# EAGLE design ESP32_can (EAGLE 6.4)
DESCRIPTION: microOBD 200 OBD-II Module; HW_REV: 1.4; PCB_REV: C; PCB_SPEC1: Layer Count: 4; PCB_SPEC2: Size: 1.3" x 0.59"; PCB_SPEC3: Finish Thickness: 0.049" - 0.052"; PCB_SPEC4: Copper Weight: 1oz; TITLE: STM1120

## Sheet 1 of 2
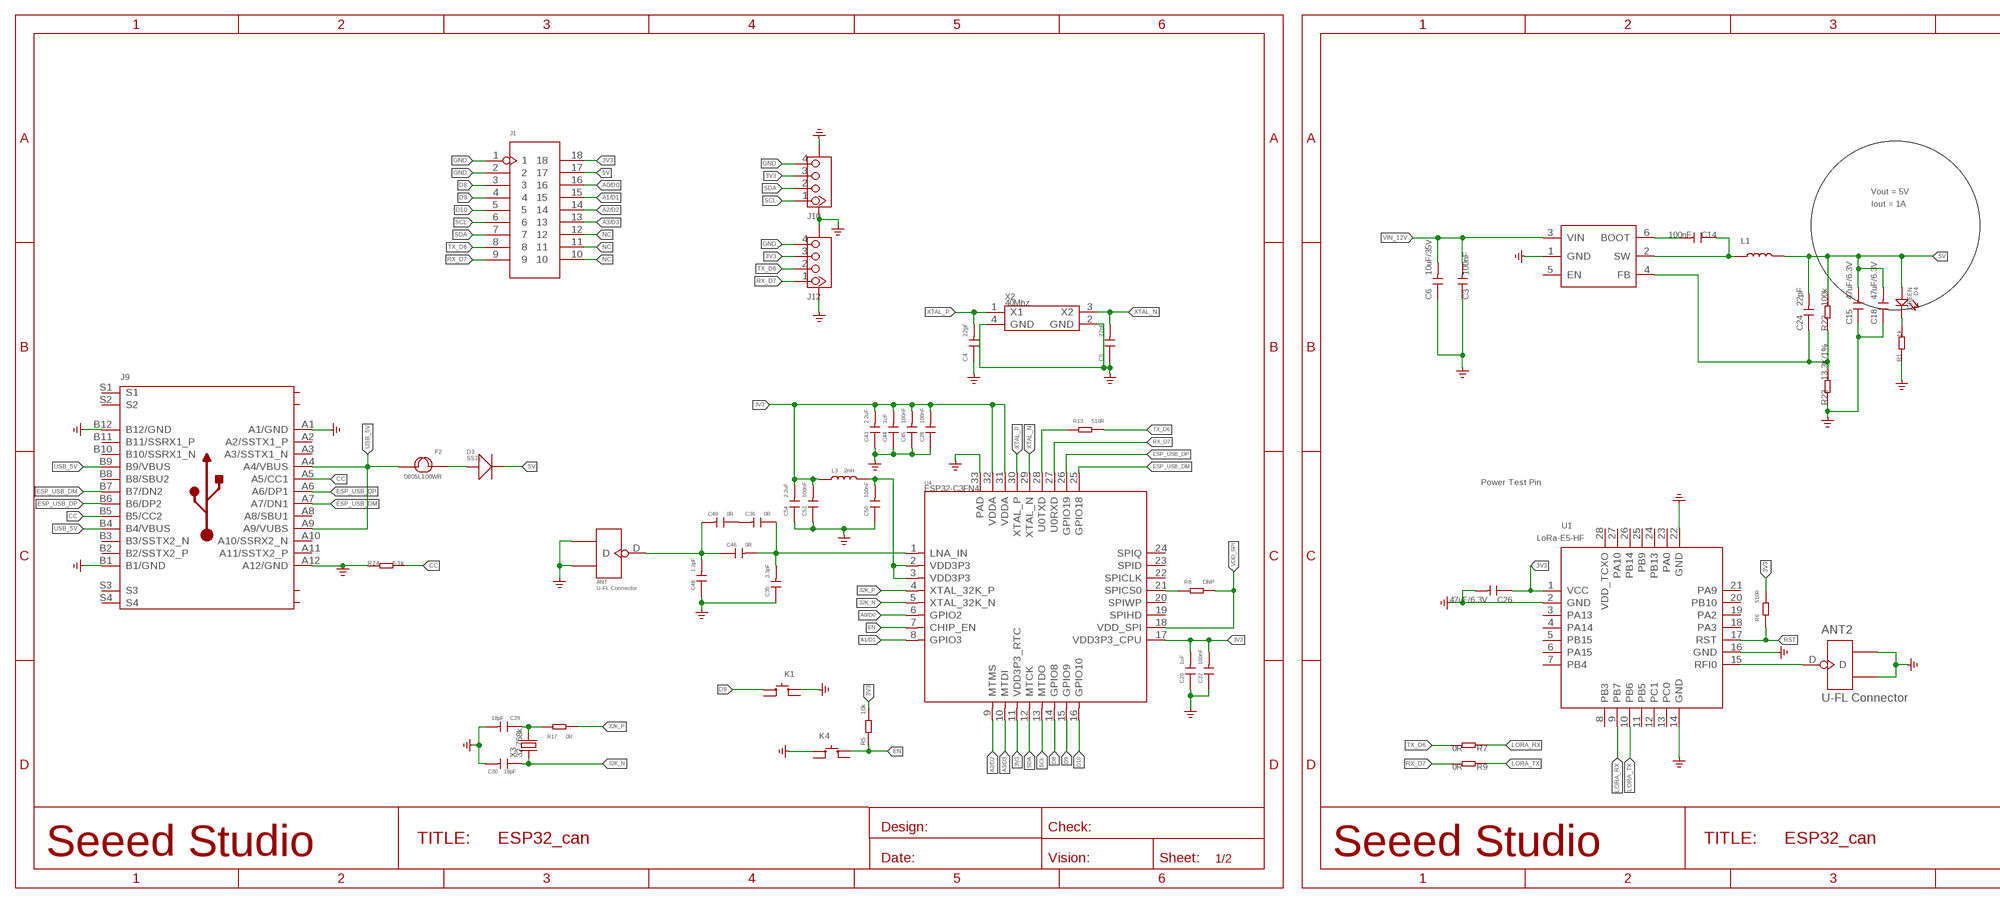
[diagram p0: schematic, sheet 1, part 1 of 2]
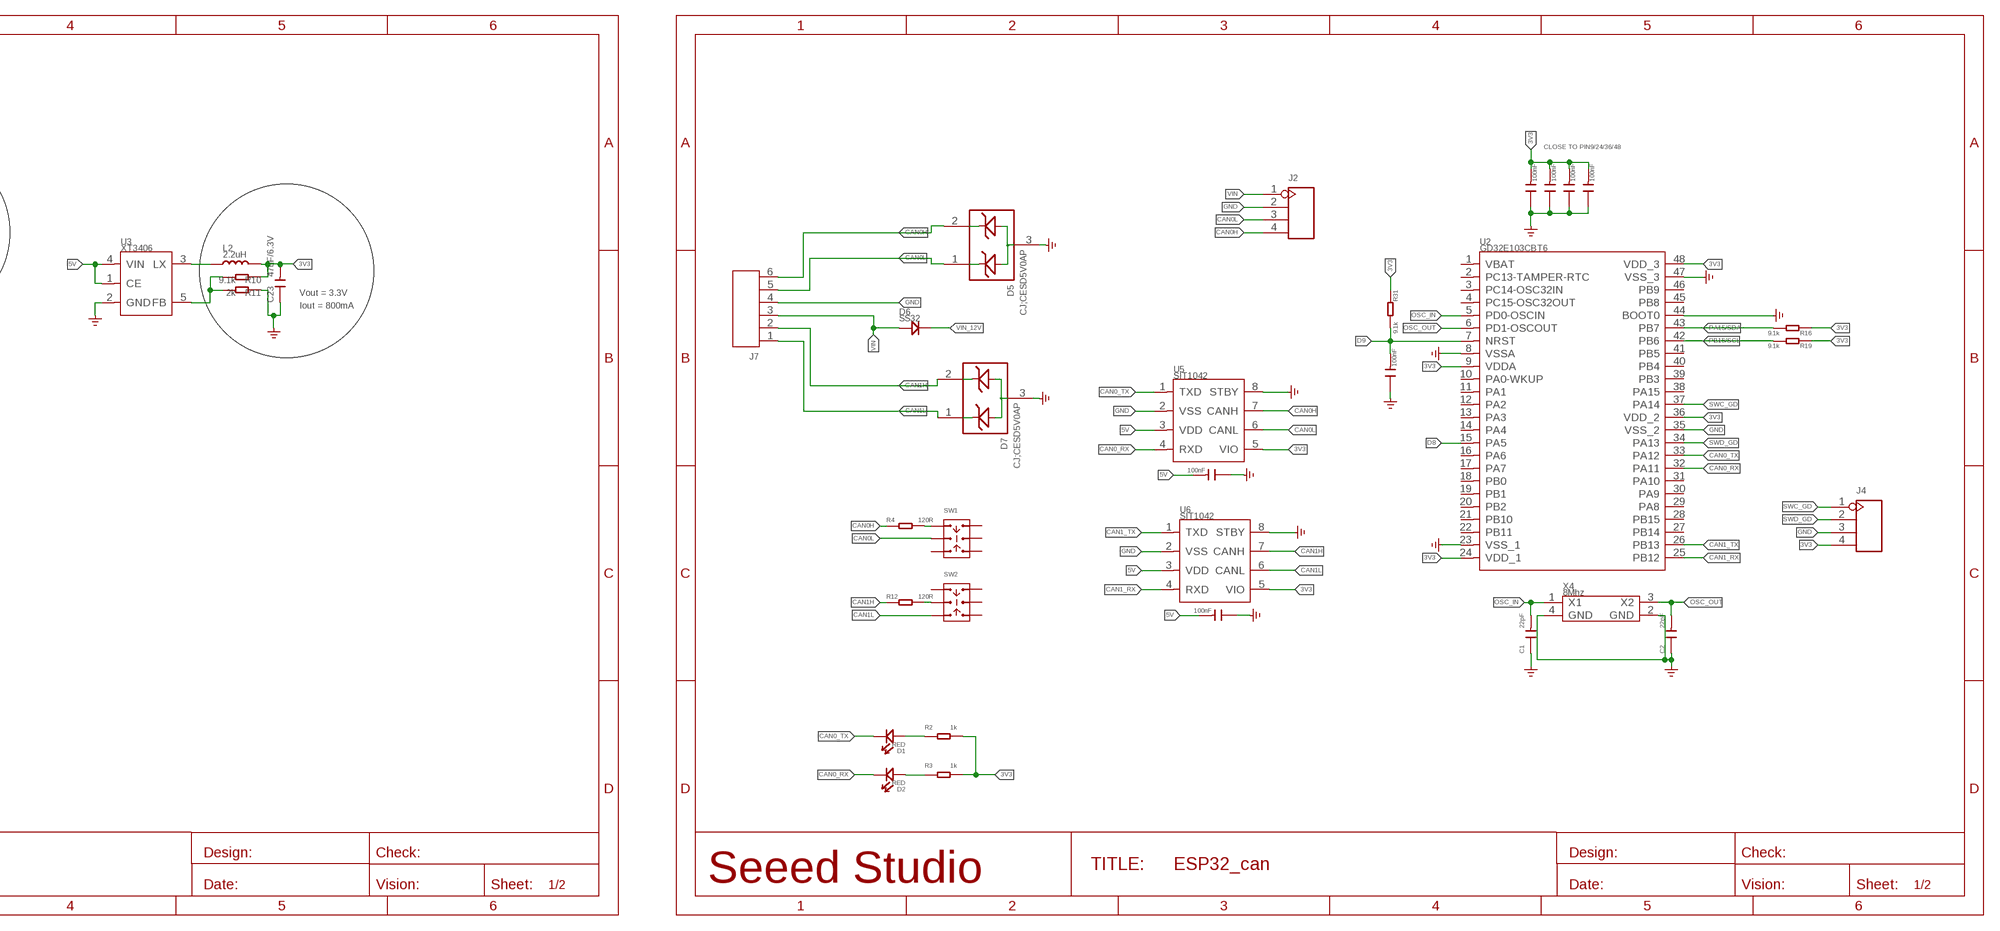
[diagram p1: schematic, sheet 1, part 2 of 2]

### Parts
ANT  U-FL Connector  ANTENNA-U-FL-320110048  [U-FL3P-SMD-2.6X2.6X1.0MM]
ANT2  U-FL Connector  ANTENNA-U-FL-320110048  [U-FL3P-SMD-2.6X2.6X1.0MM]
C1  22pF  CAP-0603  [C0603]
C2  22pF  CAP-0603  [C0603]
C3  100nF  CAP-0603  [C0603]
C4  22pF  CAP-0603  [C0603]
C5  22pF  CAP-0603  [C0603]
C6  10uF/35V  CAP-1206  [C1206]
C7  100nF  CAP-0603  [C0603]
C8  100nF  CAP-0603  [C0603]
C9  100nF  CAP-0603  [C0603]
C10  100nF  CAP-0603  [C0603]
C14  100nF  CAP-0603  [C0603]
C15  47uF/6.3V  CAP-0805  [C0805]
C16  100nF  CAP-0603  [C0603]
C17  100nF  CAP-0603  [C0603]
C18  47uF/6.3V  CAP-0805  [C0805]
C19  100nF  CAP-0603  [C0603]
C20  1uF  CAP-0603  [C0603]
C22  100nF  CAP-0603  [C0603]
C23  47uF/6.3V  CAP-0805  [C0805]
C24  22pF  CAP-0603  [C0603]
C26  47uF/6.3V  CAP-0805  [C0805]
C28  100nF  CAP-0603  [C0603]
C29  18pF  CAP-0603  [C0603]
C30  18pF  CAP-0603  [C0603]
C35  3.3pF  CAP-0603  [C0603]
C36  0R  CAP-0603  [C0603]
C43  2.2uF  CAP-0603  [C0603]
C44  1uF  CAP-0603  [C0603]
C45  100nF  CAP-0603  [C0603]
C46  0R  CAP-0603  [C0603]
C48  1.2pF  CAP-0603  [C0603]
C49  0R  CAP-0603  [C0603]
C50  100nF  CAP-0603  [C0603]
C53  100nF  CAP-0603  [C0603]
C54  2.2uF  CAP-0603  [C0603]
D1  RED  LED'0603'  [LED-0603]
D2  RED  LED'0603'  [LED-0603]
D3  SS32  DIODE'SMA'  [DO-214AC@2]
D4  GREEN  LED'0603'  [LED-0603]
D5  CJ;CESD5V0AP  D-ESD-3P'CESD3V3AP'  [SOT-23]
D6  SS32  DIODE'SMA'  [DO-214AC]
D7  CJ;CESD5V0AP  D-ESD-3P'CESD3V3AP'  [SOT-23]
F2  0805L100WR  FUSE0805  [F0805]
J1  HEADER-2X9P-2.54  [H2X9-2.54]
J2  HEADER-4P-80/40MIL  [H4-2.54-C80D40MIL]
J4  HEADER-4P-65/35MIL  [H4-2.54]
J7  SCREW-TERMINAL-6P-5.0  [H6-5.0-31.6X12.5X12MM]
J9  USB-TYPE-C-90  [TYPE-C-0.5-8.94X3.16X9.2MM]
J10  GROVE-CONNECTOR-SMD-320110030  [HW4-SMD-2.0]
J12  GROVE-CONNECTOR-SMD-320110030  [HW4-SMD-2.0]
K1  BUTTON-4P-6.2X6.2  [SW4-SMD-6.2X6.2MM]
K4  BUTTON-4P-6.2X6.2  [SW4-SMD-6.2X6.2MM]
L1  INDUCTOR-SPD3D16-4R7M  [L0420]
L2  2.2uH  INDUCTOR-3030  [L3030-TAIYO-YUDEN-NR3012]
L3  2nH  INDUCTOR'0603'  [L0603]
R1  1k  RES-0603  [R0603]
R2  1k  RES-0603  [R0603]
R3  1k  RES-0603  [R0603]
R4  120R  RES-0603  [R0603]
R5  10k  RES-0603  [R0603]
R6  510R  RES-0603  [R0603]
R7  0R  RES-0603  [R0603]
R8  DNP  RES-0603  [R0603]
R9  0R  RES-0603  [R0603]
R10  9.1k  RES-0603  [R0603]
R11  2k  RES-0603  [R0603]
R12  120R  RES-0603  [R0603]
R13  510R  RES-0603  [R0603]
R16  9.1k  RES-0603  [R0603]
R17  0R  RES-0603  [R0603]
R19  9.1k  RES-0603  [R0603]
R22  100k  RES-0603  [R0603]
R23  13.3K/1%  RES-0603  [R0603]
R24  5.1k  RES-0603  [R0603]
R31  9.1k  RES-0603  [R0603]
SW1  SWITCH-2CH-6P-311010004  [SW6-2.54-9.0X3.5X3.2+2.0MM]
SW2  SWITCH-2CH-6P-311010004  [SW6-2.54-9.0X3.5X3.2+2.0MM]
U1  LoRa-E5-HF  MOUDLE_LORA_E5  [MOUDLE28P-1.25-12X12X2.5MM]
U2  GD32E103CBT6  MCU-GD32E103CBT6  [LQFP48]
U3  XT3406  PMIC-XT3406  [SOT-23-5]
U4  ESP32-C3FN4  MCU-ESP32-C3  [QFN32G-0.5-5X5MM]
U5  SIT1042  TRANSCEIVER-MCP2542  [SOIC8-1.27-5X4MM]
U6  SIT1042  TRANSCEIVER-MCP2542  [SOIC8-1.27-5X4MM]
U9  PMIC-TPS54302  [SOT-23-6]
X2  40Mhz  CRYSTAL-4P-3225  [X4-SMD-3.2X2.5X0.7MM]
X3  32.768k  CRYSTAL-2P-1610  [X2-SMD-1.6X1.0X0.5MM]
X4  8Mhz  CRYSTAL-4P-3225  [X4-SMD-3.2X2.5X0.7MM]

### Nets
3V3: C7.2 C9.2 C16.2 C17.2 C20.2 C22.2 C23.2 C26.1 C28.2 C43.2 C44.2 C45.2 C53.2 C54.2 J1.18 J4.4 J10.3 J12.3 L2.2 L3.1 R2.2 R3.2 R5.2 R6.1 R10.1 R16.1 R19.1 R31.1 U1.1(VCC) U2.9(VDDA) U2.24(VDD_1) U2.36(VDD_2) U2.48(VDD_3) U4.11(VDD3P3_RTC) U4.17(VDD3P3_CPU) U4.31(VDDA) U4.32(VDDA) U5.5(VIO) U6.5(VIO)
5V: C8.2 C15.2 C18.2 C19.2 C24.2 D3.2(-) D4.+ J1.17 L1.2 R22.2 U3.1(CE) U3.4(VIN) U5.3(VDD) U6.3(VDD)
32K_N: C30.1 U4.5(XTAL_32K_N) X3.1
32K_P: R17.1 U4.4(XTAL_32K_P)
A0/D0: J1.16 U4.6(GPIO2)
A1/D1: J1.15 U4.8(GPIO3)
A2/D2: J1.14 U4.9(MTMS)
A3/D3: J1.13 U4.10(MTDI)
CAN0_RX: D2.- U2.32(PA11) U5.4(RXD)
CAN0_TX: D1.- U2.33(PA12) U5.1(TXD)
CAN0H: D5.2 J2.4 J7.6 R4.1 U5.7(CANH)
CAN0L: D5.1 J2.3 J7.5 SW1.COM1 U5.6(CANL)
CAN1_RX: U2.25(PB12) U6.4(RXD)
CAN1_TX: U2.26(PB13) U6.1(TXD)
CAN1H: D7.2 J7.2 R12.1 U6.7(CANH)
CAN1L: D7.1 J7.1 SW2.CH1B U6.6(CANL)
CC: J9.A5(A5/CC1) J9.B5(B5/CC2) R24.2
D8: J1.3 U2.15(PA5) U4.14(GPIO8)
D9: C10.2 J1.4 K1.2(B0) R31.2 U2.7(NRST) U4.15(GPIO9)
D10: J1.5 U4.16(GPIO10)
EN: K4.2(B0) R5.1 U4.7(CHIP_EN)
ESP_USB_DM: J9.A7(A7/DN1) J9.B7(B7/DN2) U4.25(GPIO18)
ESP_USB_DP: J9.A6(A6/DP1) J9.B6(B6/DP2) U4.26(GPIO19)
GND: ANT2.GND1 ANT2.GND2 ANT.GND1 ANT.GND2 C1.1 C2.1 C3.1 C4.1 C5.1 C6.1 C7.1 C8.1 C9.1 C10.1 C15.1 C16.1 C17.1 C18.1 C19.1 C20.1 C22.1 C23.1 C26.2 C28.1 C29.2 C30.2 C35.1 C43.1 C44.1 C45.1 C48.1 C50.1 C53.1 C54.1 D5.3 D7.3 J1.1 J1.2 J2.2 J4.3 J7.4 J9.A1(A1/GND) J9.A12(A12/GND) J9.B1(B1/GND) J9.B12(B12/GND) J10.4 J10.SS1 J10.SS2 J12.4 J12.SS1 J12.SS2 K1.1(A0) K4.1(A0) R1.1 R11.1 R23.1 R24.1 U1.2(GND) U1.14(GND) U1.16(GND) U1.22(GND) U2.8(VSSA) U2.23(VSS_1) U2.35(VSS_2) U2.44(BOOT0) U2.47(VSS_3) U3.2(GND) U4.33(PAD) U5.2(VSS) U5.8(STBY) U6.2(VSS) U6.8(STBY) U9.1(GND) X2.2(GND) X2.4(GND) X4.2(GND) X4.4(GND) ; supply symbol labelled GND_POWER
LORA_RX: R7.1 U1.9(PB7)
LORA_TX: R9.1 U1.10(PB6)
N$1: D4.- R1.2
N$2: D1.+ R2.1
N$3: C14.1 L1.1 U9.2(SW)
N$4: ANT2.D U1.15(RFI0)
N$5: R4.2 SW1.CH1A
N$7: R12.2 SW2.COM1
N$8: L2.1 U3.3(LX)
N$11: D3.1(+) F2.1
N$14: R13.2 U4.28(U0TXD)
N$15: D2.+ R3.1
N$16: R10.2 R11.2 U3.5(FB)
N$17: R8.1 U4.21(SPICS0)
N$21: C29.1 R17.2 X3.2
N$22: C35.2 C36.1 C46.2 U4.1(LNA_IN)
N$23: C36.2 C49.1
N$27: C14.2 U9.6(BOOT)
N$28: ANT.D C46.1 C48.2 C49.2
N$29: C24.1 R22.1 R23.2 U9.4(FB)
N$34: C50.2 L3.2 U4.2(VDD3P3) U4.3(VDD3P3)
NC: J1.10 J1.11 J1.12
OSC_IN: C1.2 U2.5(PD0-OSCIN) X4.1(X1)
OSC_OUT: C2.2 U2.6(PD1-OSCOUT) X4.3(X2)
PA15/SDA: R16.2 U2.43(PB7)
PB15/SCL: R19.2 U2.42(PB6)
RST: R6.2 U1.17(RST)
RX_D7: J1.9 J12.1 R9.2 U4.27(U0RXD)
SCL: J1.6 J10.1 U4.13(MTDO)
SDA: J1.7 J10.2 U4.12(MTCK)
SWC_GD: J4.1 U2.37(PA14)
SWD_GD: J4.2 U2.34(PA13)
TX_D6: J1.8 J12.2 R7.2 R13.1
USB_5V: F2.2 J9.A4(A4/VBUS) J9.A9(A9/VUBS) J9.B4(B4/VBUS) J9.B9(B9/VBUS)
VDD_SPI: R8.2 U4.18(VDD_SPI)
VIN: D6.1(+) J2.1 J7.3
VIN_12V: C3.2 C6.2 D6.2(-) U9.3(VIN)
XTAL_N: C5.2 U4.29(XTAL_N) X2.3(X2)
XTAL_P: C4.2 U4.30(XTAL_P) X2.1(X1)
Unconnected: J9.A2(A2/SSTX1_P) J9.A3(A3/SSTX1_N) J9.A8(A8/SBU1) J9.A10(A10/SSRX2_N) J9.A11(A11/SSTX2_P) J9.B2(B2/SSTX2_P) J9.B3(B3/SSTX2_N) J9.B8(B8/SBU2) J9.B10(B10/SSRX1_N) J9.B11(B11/SSRX1_P) J9.S1 J9.S2 J9.S3 J9.S4 K1.3(B1) K1.4(A1) K4.3(B1) K4.4(A1) SW1.CH1B SW1.CH2A SW1.CH2B SW1.COM2 SW2.CH1A SW2.CH2A SW2.CH2B SW2.COM2 U1.3(PA13) U1.4(PA14) U1.5(PB15) U1.6(PA15) U1.7(PB4) U1.8(PB3) U1.11(PB5) U1.12(PC1) U1.13(PC0) U1.18(PA3) U1.19(PA2) U1.20(PB10) U1.21(PA9) U1.23(PA0) U1.24(PB13) U1.25(PB9) U1.26(PB14) U1.27(PA10) U1.28(VDD_TCXO) U2.1(VBAT) U2.2(PC13-TAMPER-RTC) U2.3(PC14-OSC32IN) U2.4(PC15-OSC32OUT) U2.10(PA0-WKUP) U2.11(PA1) U2.12(PA2) U2.13(PA3) U2.14(PA4) U2.16(PA6) U2.17(PA7) U2.18(PB0) U2.19(PB1) U2.20(PB2) U2.21(PB10) U2.22(PB11) U2.27(PB14) U2.28(PB15) U2.29(PA8) U2.30(PA9) U2.31(PA10) U2.38(PA15) U2.39(PB3) U2.40(PB4) U2.41(PB5) U2.45(PB8) U2.46(PB9) U4.19(SPIHD) U4.20(SPIWP) U4.22(SPICLK) U4.23(SPID) U4.24(SPIQ) U9.5(EN)

### Notes on the sheet
- CLOSE TO PIN9/24/36/48
- Vout = 5V
- Iout = 1A
- Vout = 3.3V
- Iout = 800mA
- Power Test Pin

## Sheet 2 of 2

## Library data of the parts
ANT ANT2 = Connector-new:ANTENNA-U-FL
C1-C10 C14-C20 C22-C24 C26 C28-C30 C35 C36 C43-C46 C48-C50 C53 C54 = Discrete-new:CAP: Ceramic Capacitors
D1 D2 D4 = Discrete-new:LED
D3 = Discrete-new:DIODE*
D5 D7 = Discrete-new:D-ESD-3P: 304060003
D6 = Discrete-new:DIODE
F2 = Discrete-small:FUSE
J1 = Connector-new:HEADER-2X9P
J2 J4 = Connector-new:HEADER-4P
J7 = 0617:SCREW-TERMINAL-6P: 320110059
J9 = Connector-new:USB-TYPE-C
J10 J12 = Connector-new:GROVE-CONNECTOR-SMD
K1 K4 = Switch:BUTTON-4P
L1-L3 = Discrete-new:INDUCTOR
R1-R13 R16 R17 R19 R22-R24 R31 = Discrete-new:RES
SW1 SW2 = Switch:SWITCH-2CH-6P
U1 = moudle-new:MOUDLE_LORA_E5
U2 = Longan-IC:MCU-GD32E103CBT6
U3 = PMIC:PMIC-XT3406
U4 = IC-new:MCU-ESP32-C3
U5 U6 = untitled:TRANSCEIVER-MCP2542
U9 = IC-new:PMIC-TPS54302
X2 X4 = Discrete-new:CRYSTAL-4P
X3 = Discrete-new:CRYSTAL-2P

## Net classes
3 usbvcc: width 0.152 mm, drill 0.152 mm, clearance 0.152 mm

## Board
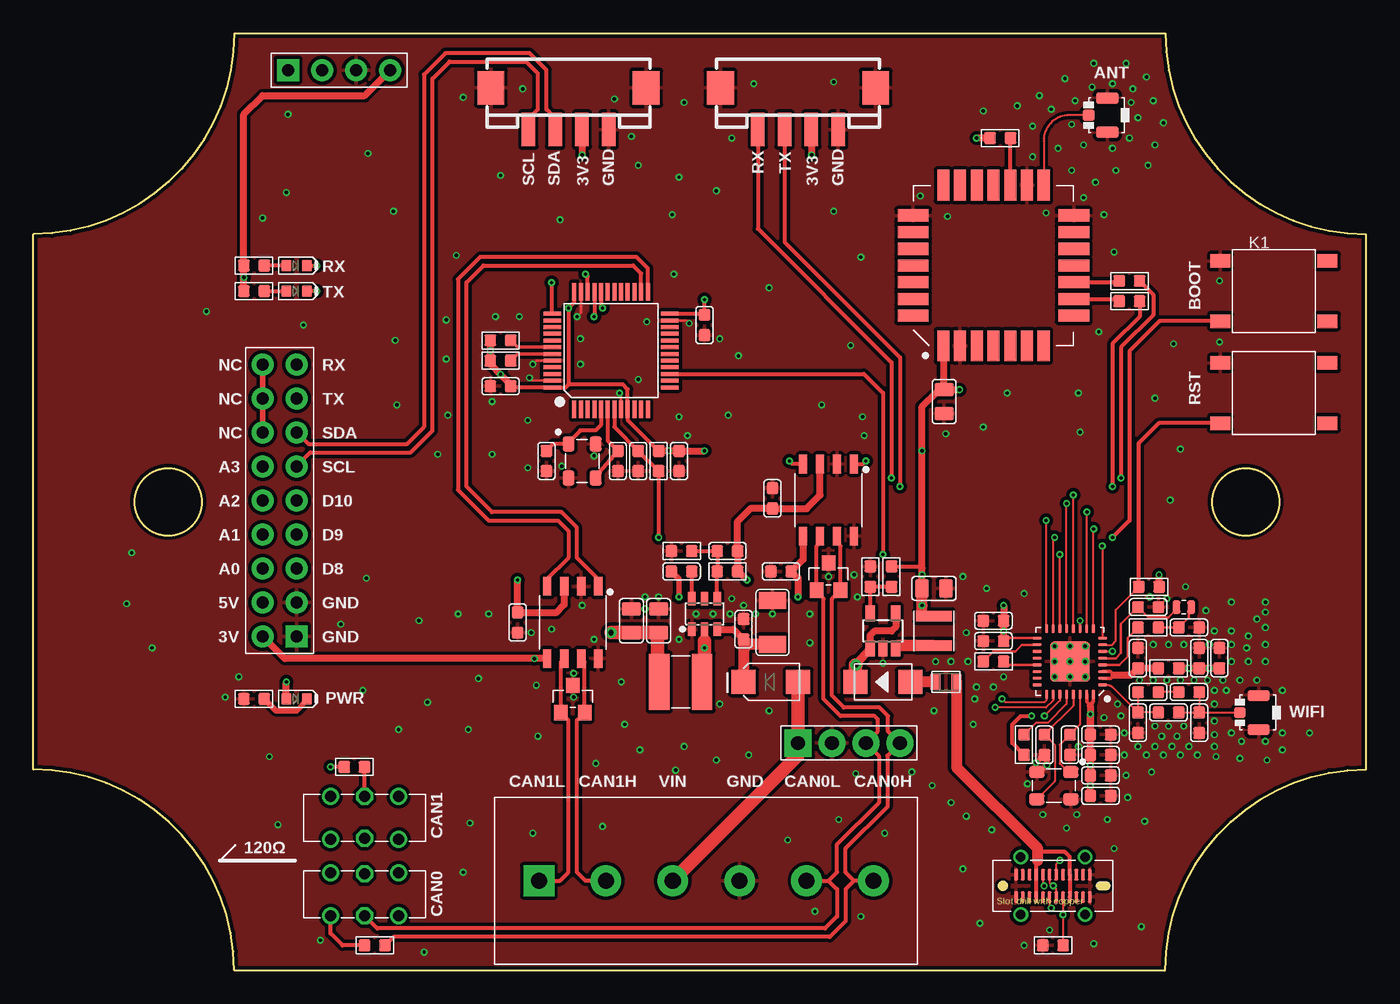
[diagram p2: board, top side]
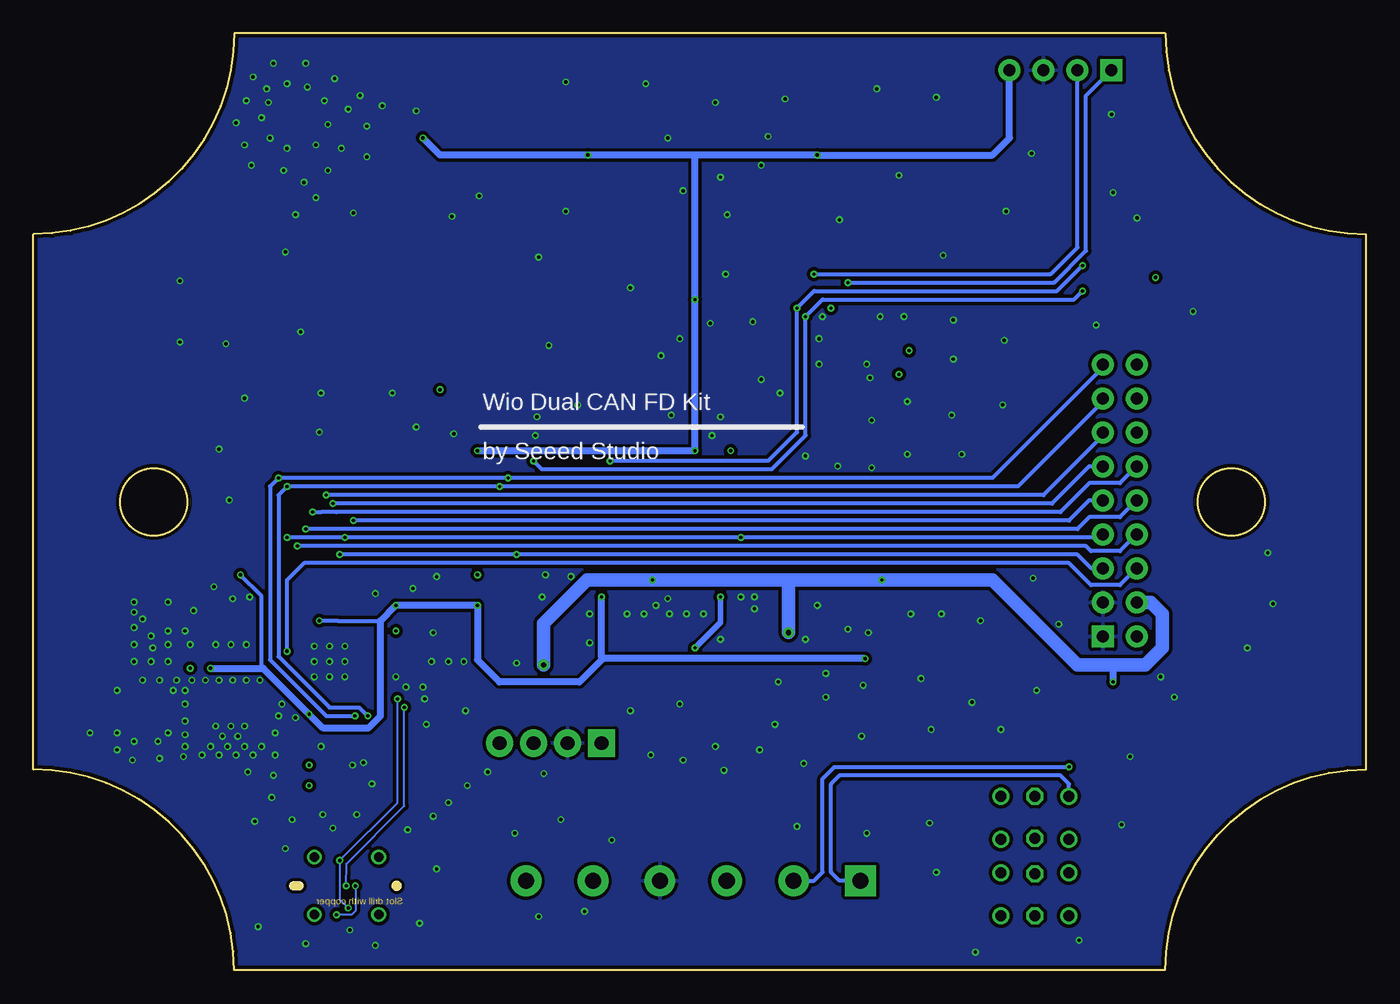
[diagram p3: board, bottom side, seen from below]

Size 99.57 x 70 mm. Coordinates in mm from the lower left corner, seen from the top.
Outline: 15,70 84.57,70 arc90 99.57,55 99.57,15 arc90 84.57,0 15,0 arc90 0,15 0,55 arc90 15,70
Outline: circle at 10.07,35 radius 2.5
Outline: circle at 90.57,35 radius 2.5
Copper layers (1*16): Top 0.035mm / dielectric 1.5mm / Bottom 0.035mm
Design rules "SeeedStudio_2layer_DRU_no_angle_20140221": minimum track width 1mil, minimum drill 10mil, track to track 6mil, track to pad 6mil, pad to pad 6mil, via to via 6mil, smd to smd 0mil, copper to edge 10mil, drill to drill 10mil, minimum pad ring 4mil, minimum via ring 4mil, stop-mask expansion 2mil, vias tented up to drill 25mil, thermal gap 10mil

### Footprints (pad centres in the part's own frame; a part is rotated, then mirrored left to right if it is on the bottom)
U-FL3P-SMD-2.6X2.6X1.0MM = smd 0.889 x 0.838: D -1.397,0 | smd 1.676 x 0.838: GND1 0,1.27; GND2 0,-1.27
C0603 = smd 0.889 x 0.889: 1 -0.762,0; 2 0.762,0
C1206 = smd 1.27 x 2.032: 1 -1.651,0; 2 1.651,0
C0805 = smd 1.016 x 1.397: 1 -0.889,0; 2 0.889,0
LED-0603 = smd 0.762 x 0.889: + 0.762,0; - -0.762,0
DO-214AC@2 = smd 1.8 x 1.77: 1 -2.042,0; 2 2.042,0
SOT-23 = smd 1.016 x 1.143: 1 -0.889,-1.016; 2 0.889,-1.016; 3 0,1.016
DO-214AC = smd 1.8 x 1.77: 1 2.042,0; 2 -2.042,0
F0805 = smd 0.819 x 1.27: 1 -0.79,0; 2 0.79,0
H2X9-2.54 = drill 0.889 pad 1.651 square: 1 -1.27,10.16 | drill 0.889 pad 1.651: 2 -1.27,7.62; 3 -1.27,5.08; 4 -1.27,2.54; 5 -1.27,0; 6 -1.27,-2.54; 7 -1.27,-5.08; 8 -1.27,-7.62; 9 -1.27,-10.16; 10 1.27,-10.16; 11 1.27,-7.62; 12 1.27,-5.08; 13 1.27,-2.54; 14 1.27,0; 15 1.27,2.54; 16 1.27,5.08; 17 1.27,7.62; 18 1.27,10.16
H4-2.54-C80D40MIL = drill 1.016 pad 2.032 square: 1 0,3.81 | drill 1.016 pad 2.032: 2 0,1.27; 3 0,-1.27; 4 0,-3.81
H4-2.54 = drill 0.889 pad 1.651 square: 1 0,3.81 | drill 0.889 pad 1.651: 2 0,1.27; 3 0,-1.27; 4 0,-3.81
H6-5.0-31.6X12.5X12MM = drill 1.2 pad 2.3 square: 1 -12.5,0 | drill 1.2 pad 2.3: 2 -7.5,0; 3 -2.5,0; 4 2.5,0; 5 7.5,0; 6 12.5,0
TYPE-C-0.5-8.94X3.16X9.2MM = smd 0.3 x 0.85: A1 -2.75,0.835; A2 -2.25,0.835; A3 -1.75,0.835; A4 -1.25,0.835; A5 -0.75,0.835; A6 -0.25,0.835; A7 0.25,0.835; A8 0.75,0.835; A9 1.25,0.835; A10 1.75,0.835; A11 2.25,0.835; A12 2.75,0.835; B1 2.75,-0.835; B2 2.25,-0.835; B3 1.75,-0.835; B4 1.25,-0.835; B5 0.75,-0.835; B6 0.25,-0.835; B7 -0.25,-0.835; B8 -0.75,-0.835; B9 -1.25,-0.835; B10 -1.75,-0.835; B11 -2.25,-0.835; B12 -2.75,-0.835 | drill 0.7 pad 1.1: S1 -2.4,2.15; S2 2.4,2.15; S3 2.4,-2.15; S4 -2.4,-2.15 | hole 0.65: -3.75,0 | hole 0.6: 3.55,0.001; 3.677,0.001; 3.804,0.001; 3.931,0.001; 3.951,0.001
HW4-SMD-2.0 = smd 1 x 2.5: 1 -3,0; 2 -1,0; 3 1,0; 4 3,0 | smd 2 x 2.5: SS1 -5.8,3.123; SS2 5.8,3.123
SW4-SMD-6.2X6.2MM = smd 1.5 x 1: 1 -4,2.25; 2 -4,-2.25; 3 4,-2.25; 4 4,2.25
L0420 = smd 1.5 x 4.2: 1 -1.6,0; 2 1.6,0
L3030-TAIYO-YUDEN-NR3012 = smd 0.8 x 2.7: 1 -1.1,0; 2 1.1,0
L0603 = smd 0.889 x 0.889: 1 -0.762,0; 2 0.762,0
R0603 = smd 0.889 x 0.889: 1 -0.762,0; 2 0.762,0
SW6-2.54-9.0X3.5X3.2+2.0MM = drill 0.813 pad 1.27: CH1A -2.54,-1.6; CH1B 2.54,-1.6; CH2A -2.54,1.6; CH2B 2.54,1.6 | drill 0.813 pad 1.27 octagon: COM1 0,-1.6; COM2 0,1.524
MOUDLE28P-1.25-12X12X2.5MM = smd 2.3 x 0.9: 1 -6,3.75; 2 -6,2.5; 3 -6,1.25; 4 -6,0; 5 -6,-1.25; 6 -6,-2.5; 7 -6,-3.75; 15 6,-3.75; 16 6,-2.5; 17 6,-1.25; 18 6,0; 19 6,1.25; 20 6,2.5; 21 6,3.75 | smd 0.9 x 2.3: 8 -3.75,-6; 9 -2.5,-6; 10 -1.25,-6; 11 0,-6; 12 1.25,-6; 13 2.5,-6; 14 3.75,-6; 22 3.75,6; 23 2.5,6; 24 1.25,6; 25 0,6; 26 -1.25,6; 27 -2.5,6; 28 -3.75,6
LQFP48 = smd 1.3 x 0.3: 1 -4.4,2.75; 2 -4.4,2.25; 3 -4.4,1.75; 4 -4.4,1.25; 5 -4.4,0.75; 6 -4.4,0.25; 7 -4.4,-0.25; 8 -4.4,-0.75; 9 -4.4,-1.25; 10 -4.4,-1.75; 11 -4.4,-2.25; 12 -4.4,-2.75; 25 4.4,-2.75; 26 4.4,-2.25; 27 4.4,-1.75; 28 4.4,-1.25; 29 4.4,-0.75; 30 4.4,-0.25; 31 4.4,0.25; 32 4.4,0.75; 33 4.4,1.25; 34 4.4,1.75; 35 4.4,2.25; 36 4.4,2.75 | smd 0.3 x 1.3: 13 -2.75,-4.4; 14 -2.25,-4.4; 15 -1.75,-4.4; 16 -1.25,-4.4; 17 -0.75,-4.4; 18 -0.25,-4.4; 19 0.25,-4.4; 20 0.75,-4.4; 21 1.25,-4.4; 22 1.75,-4.4; 23 2.25,-4.4; 24 2.75,-4.4; 37 2.75,4.4; 38 2.25,4.4; 39 1.75,4.4; 40 1.25,4.4; 41 0.75,4.4; 42 0.25,4.4; 43 -0.25,4.4; 44 -0.75,4.4; 45 -1.25,4.4; 46 -1.75,4.4; 47 -2.25,4.4; 48 -2.75,4.4
SOT-23-5 = smd 0.69 x 1.2: 1 -0.95,-1.3; 2 0,-1.3; 3 0.95,-1.3; 4 0.95,1.3; 5 -0.95,1.3
QFN32G-0.5-5X5MM = smd 0.25 x 0.7: 1 -1.75,-2.45; 2 -1.25,-2.45; 3 -0.75,-2.45; 4 -0.25,-2.45; 5 0.25,-2.45; 6 0.75,-2.45; 7 1.25,-2.45; 8 1.75,-2.45; 17 1.75,2.45; 18 1.25,2.45; 19 0.75,2.45; 20 0.25,2.45; 21 -0.25,2.45; 22 -0.75,2.45; 23 -1.25,2.45; 24 -1.75,2.45 | smd 0.7 x 0.25: 9 2.45,-1.75; 10 2.45,-1.25; 11 2.45,-0.75; 12 2.45,-0.25; 13 2.45,0.25; 14 2.45,0.75; 15 2.45,1.25; 16 2.45,1.75; 25 -2.45,1.75; 26 -2.45,1.25; 27 -2.45,0.75; 28 -2.45,0.25; 29 -2.45,-0.25; 30 -2.45,-0.75; 31 -2.45,-1.25; 32 -2.45,-1.75 | smd 3 x 3: 33 0,0
SOIC8-1.27-5X4MM = smd 0.6 x 1.4: 1 -1.905,-2.7; 2 -0.635,-2.7; 3 0.635,-2.7; 4 1.905,-2.7; 5 1.905,2.7; 6 0.635,2.7; 7 -0.635,2.7; 8 -1.905,2.7
SOT-23-6 = smd 0.55 x 1.016: 1 -0.95,-1.143; 2 0,-1.143; 3 0.95,-1.143; 4 0.95,1.143; 5 0,1.143; 6 -0.95,1.143
X4-SMD-3.2X2.5X0.7MM = smd 1.143 x 0.889: 1 -1.27,-1.016; 2 1.27,-1.016; 3 1.27,1.016; 4 -1.27,1.016
X2-SMD-1.6X1.0X0.5MM = smd 0.6 x 1: 1 -0.55,0; 2 0.55,0

### Placement (x,y rotation side)
ANT  91.54,19.25 0 top
ANT2  80.24,63.89 0 top
C1  38.33,38.05 90 top
C2  43.66,38.05 90 top
C3  53.06,25.48 270 top
C4  77.45,16.84 90 top
C5  75.54,16.84 90 top
C6  55.22,25.98 270 top
C7  55.86,29.79 0 top
C8  55.22,35.25 270 top
C9  50.14,48.21 90 top
C10  45.19,38.05 90 top
C14  48.43,29.79 0 top
C15  46.71,26.11 270 top
C16  34.9,43.64 0 top
C17  48.24,38.05 90 top
C18  44.68,26.11 270 top
C19  36.17,25.98 90 top
C20  71.73,26.11 0 top
C22  71.73,24.59 0 top
C23  67.29,28.52 180 top
C24  51.86,31.32 0 top
C26  68.05,42.49 270 top
C28  79.73,16.08 180 top
C29  86.34,25.6 0 top
C30  83.29,27.13 0 top
C35  82.53,18.49 90 top
C36  83.29,20.78 0 top
C43  79.73,13.03 180 top
C44  79.73,14.55 180 top
C45  79.73,17.6 180 top
C46  84.81,19.25 180 top
C48  87.1,18.49 90 top
C49  86.34,20.78 0 top
C50  82.53,23.32 270 top
C53  87.1,23.32 270 top
C54  88.62,23.32 270 top
D1  19.66,50.75 180 top
D2  19.66,52.65 180 top
D3  63.48,21.54 180 top
D4  19.66,20.27 180 top
D5  59.41,29.41 0 top
D6  55.09,21.54 0 top
D7  40.3,20.27 0 top
F2  68.17,21.54 0 top
J1  18.39,35.1 180 top
J2  60.94,16.97 90 top
J4  22.84,67.26 90 top
J7  50.27,6.68 0 top
J9  76.18,6.3 0 top
J10  39.98,62.81 0 top
J12  57.13,62.81 0 top
K1  92.69,50.75 0 top
K4  92.69,43.13 0 top
L1  48.36,21.54 180 top
L2  67.29,25.35 90 top
L3  84.81,22.55 180 top
R1  16.49,20.27 0 top
R2  16.49,50.75 180 top
R3  16.49,52.65 180 top
R4  25.5,1.85 180 top
R5  83.35,28.65 0 top
R6  72.24,62.18 0 top
R7  81.89,49.99 0 top
R8  71.73,23.06 180 top
R9  81.89,51.51 0 top
R10  64.11,29.41 270 top
R11  62.52,29.41 270 top
R12  23.98,15.19 0 top
R13  74.02,16.84 90 top
R16  34.9,45.54 0 top
R17  83.29,25.6 0 top
R19  34.9,47.06 0 top
R22  51.86,29.79 0 top
R23  48.43,31.32 0 top
R24  76.18,1.85 0 top
R31  46.71,38.05 270 top
SW1  24.74,5.66 0 top
SW2  24.74,11.38 180 top
U1  71.73,52.65 90 top
U2  43.16,46.3 90 top
U3  63.48,25.35 0 top
U4  77.45,23.06 90 top
U5  59.41,35.13 180 top
U6  40.3,25.98 180 top
U9  50.14,26.62 0 top
X2  76.24,13.79 180 top
X3  85.95,27.13 0 top
X4  41,38.05 270 top

### Tracks (layer width: path | path; a pad name or v marks a point on that pad's centre or on a via)
3V3  (via drill 0.25 pad 0.51)
  Top 0.152: U4.11 78.2,26.1 v78.21,26.11
  Top 0.203: U4.17 72.97,24.81 C22.2
  Top 0.254: U4.31 78.7,20.03 78.97,19.76 79.2,20.11 U4.32
  Top 0.305: R31.1 44.41,41.12 U2.9 44.41,43.4 44.04,43.76 39.98,43.76 | v66.4,29.54 C23.2 | U2.24 50.06,49.05 C9.2 v50.14,50.11 | C16.2 35.75,43.55 U2.48 39.77,43.55 39.98,43.76 | U2.36 40.41,49.9 v39.98,49.48 39.98,43.76 | R10.1 66.27,30.17 66.4,30.05
  Top 0.508: L3.1 v86.34,22.55 C53.2 v87.86,22.55 C54.2 | 78.97,19.76 v78.97,19.12 | C22.2 v72.49,25.35 C20.2 v72.49,27.25 | R31.1 v47.47,38.81 C17.2 v50.14,38.81 | C43.2 v78.97,13.79 C44.2 v78.97,15.32 C28.2 v78.97,19.12 | v78.97,19.12 C45.2 | U5.5 57.51,30.68 C7.2 57.13,29.29 v57.13,27.89 | U1.1 67.98,43.45 C26.1 | R19.1 v34.14,46.3 R16.1 34.14,45.29 v34.9,44.52 35.66,43.76 C16.2 | R5.2 v84.11,29.54 | C26.1 v69.19,43.38 | R6.1 v70.46,62.18 | J12.3 58.13,60.92 v58.14,60.91 | J10.3 40.98,60.92 v41,60.91 | R2.2 v15.72,51.76 R3.2 15.72,63.96 17.12,65.35 24.74,65.35 J4.4 | C23.2 66.4,30.05 v66.4,38.81 66.4,42.11 67.54,43.26 67.92,43.26 C26.1 | U6.5 v37.44,23.28 18.78,23.28 J1.18
  Top 0.813: L2.2 66.57,26.45 66.4,26.62 v66.4,27.25 C23.2
  Bottom 0.305: v86.34,22.55 83.29,22.55 | 82.53,22.55 82.53,27.95 v84.11,29.54 | v72.49,27.25 73.65,26.1 76.85,26.1 78.2,26.1 v78.21,26.11
  Bottom 0.508: v86.34,22.55 82.53,22.55 82.4,22.55 v78.97,19.12 77.95,18.11 74.53,18.11 73.64,19 73.64,26.11 v72.49,27.25 v66.4,27.25 66.4,23.19 64.75,21.54 58.78,21.54 57.13,23.19 57.13,23.44 | 50.01,60.91 v41,60.91 27.92,60.91 26.65,62.18 J4.4 | 50.01,60.91 v58.14,60.91 69.19,60.91 v70.46,62.18 | 50.01,60.91 50.14,60.78 v50.14,50.11 v50.14,38.81 v66.4,38.81 | v37.44,23.28 56.97,23.28 57.13,23.44 | 57.13,23.44 v57.13,27.89
5V  (via drill 0.25 pad 0.51, 0.38 pad 0.81)
  Top 0.508: U5.3 58.78,35.51 57.76,34.49 C8.2 53.57,34.49 52.62,33.54 C24.2 R22.2 52.68,29.79 v53.32,29.16 | v36.17,29.16 C19.2 39.09,26.75 39.66,27.32 U6.3 | U3.4 64.43,25.66 64.11,25.35 62.84,25.35 62.53,25.03 U3.1 | D4.+ v18.9,21.54
  Top 0.635: U3.1 61.51,22.87 v61.44,22.81 61.44,21.8 D3.2
  Top 0.813: L1.2 46.64,25.04 C15.2 C18.2
  Top 1.016: 46.64,25.04 46.64,22.25 46.71,22.17 | 46.58,25.22 C18.2 v43.16,25.22 | D3.2 v61.43,22.8 v61.44,22.81
  Bottom 0.508: v18.9,21.54 18.9,22.81
  Bottom 1.016: J1.17 16.08,27.48 15.22,26.62 15.22,24.08 16.49,22.81 18.9,22.81 21.57,22.81 27.92,29.16 v36.17,29.16 43.16,29.16 | 43.16,29.16 v53.32,29.16 58.21,29.16 61.44,25.92 v61.44,22.81 | v43.16,25.22 43.16,29.16
32K_N
  Top 0.203: U4.5 80.87,23.31 81.26,23.7 81.26,25.86 C30.1 83.29,26.36 84.81,26.36 85.41,26.96 X3.1
32K_P
  Top 0.203: U4.4 81.13,22.81 81.76,23.45 81.76,24.84 R17.1
A0/D0  (via drill 0.25 pad 0.51)
  Top 0.152: U4.6 80.61,23.81 v80.62,23.82
  Bottom 0.305: J1.16 17.15,30.02 18.39,28.78 20.55,28.78 22.2,30.43 79.35,30.43 80.62,29.16 v80.62,23.82
A1/D1  (via drill 0.25 pad 0.51)
  Top 0.152: U4.8 79.9,31.66 v79.86,31.7
  Bottom 0.305: J1.15 17.15,32.56 18.39,31.32 20.55,31.32 20.93,31.7 v79.86,31.7
A2/D2  (via drill 0.25 pad 0.51)
  Top 0.152: U4.9 79.2,32.94 v79.22,32.97
  Bottom 0.305: J1.14 17.15,35.1 18.39,33.86 20.68,33.86 21.57,32.97 v79.22,32.97
A3/D3  (via drill 0.25 pad 0.51)
  Top 0.152: U4.10 78.7,34.22 v78.72,34.24
  Bottom 0.305: J1.13 17.15,37.64 18.39,36.4 20.68,36.4 22.84,34.24 76.94,34.24 78.08,34.24 v78.72,34.24
CAN0_RX  (via drill 0.25 pad 0.51)
  Top 0.305: D2.- v21.19,52.65 | U2.32 42.41,49.59 v42.52,49.48 | U5.4 56.71,37.83 v56.49,38.05
  Bottom 0.305: v21.19,52.65 23.09,50.75 41.25,50.75 v42.52,49.48 42.52,40.21 44.68,38.05 v56.49,38.05
CAN0_TX  (via drill 0.25 pad 0.51)
  Top 0.305: U2.33 41.91,48.86 v41.89,48.84 | v21.19,50.75 D1.- | U5.1 61.98,37.83 v62.21,38.05
  Bottom 0.305: v21.19,50.75 21.82,50.11 40.62,50.11 v41.89,48.84 41.89,39.95 44.43,37.41 61.57,37.41 v62.21,38.05
CAN0H
  Top 0.305: R4.1 26.9,2.49 59.51,2.49 60.68,3.66 60.68,6.04 61.32,6.68 | U5.7 60.17,32.3 60.17,31.82 60.3,31.7 D5.2 59.67,27.76 59.67,20.52 60.55,19.63 63.22,19.63 63.86,19 63.86,17.86 J2.4 63.79,16.01 63.79,12.2 60.68,9.09 60.68,7.31 61.32,6.68 | J7.6 61.32,6.68
CAN0L
  Top 0.305: U5.6 58.78,31.95 58.52,31.7 D5.1 59.03,27.76 59.03,20.27 60.3,19 62.84,19 63.09,18.74 63.09,17.86 J2.3 63.16,16.01 63.16,12.52 60.05,9.41 60.05,7.31 59.41,6.68 | J7.5 59.41,6.68 | 59.41,6.68 60.05,6.04 60.05,4.01 59.16,3.12 25.68,3.12 SW1.COM1
CAN1_RX
  Top 0.305: U6.4 38.39,29.22 39.98,30.81 39.98,32.81 39.19,33.6 34.01,33.6 31.73,35.89 31.73,51.64 33.38,53.29 45.06,53.29 45.91,52.44 U2.25
CAN1_TX
  Top 0.305: U6.1 42.2,29.22 40.62,30.81 40.62,33.07 39.45,34.24 34.27,34.24 32.36,36.14 32.36,51.38 33.63,52.65 44.81,52.65 45.41,52.05 U2.26
CAN1H  (via drill 0.25 pad 0.51)
  Top 0.305: J7.2 41.25,6.68 40.62,7.31 40.62,18.68 D7.2 41.19,23.03 U6.7 | R12.1 v22.2,15.19
  Bottom 0.305: J7.2 41.25,6.68 40.62,7.31 40.62,14.3 39.73,15.19 v22.2,15.19
CAN1L
  Top 0.305: J7.1 39.35,6.68 39.98,7.31 39.98,18.68 D7.1 39.41,23.03 U6.6
  Bottom 0.305: J7.1 39.35,6.68 39.98,7.31 39.98,13.92 39.35,14.55 22.84,14.55 22.2,13.92 SW2.CH1B
CC  (via drill 0.25 pad 0.51)
  Top 0.152: J9.A5 75.43,6.39 v75.52,6.3 | J9.B5 v76.93,4.14 76.93,3.38 76.93,1.86
  Top 0.305: 76.93,1.86 R24.2
  Bottom 0.152: v75.52,6.3 75.52,4.42 75.8,4.14 v76.93,4.14
D8  (via drill 0.25 pad 0.51)
  Top 0.152: U4.14 76.7,31.05 v76.68,31.06
  Top 0.305: U2.15 62.05,44.55 63.48,43.13 v63.48,31.06
  Bottom 0.305: J1.3 20.52,30.02 21.57,31.06 v63.48,31.06 v76.68,31.06
D9  (via drill 0.25 pad 0.51)
  Top 0.152: U4.15 76.2,32.19 v76.3,32.33
  Top 0.305: v46.71,32.33 R31.2 C10.2 43.41,40.59 U2.7 | v80.62,32.33 81.89,33.6 81.89,46.25 84.14,48.5 K1.2
  Bottom 0.305: J1.4 19.69,32.56 19.91,32.33 v46.71,32.33 v76.3,32.33 v80.62,32.33
D10  (via drill 0.25 pad 0.51)
  Top 0.152: U4.16 75.7,33.58 v75.67,33.6
  Bottom 0.305: J1.5 20.7,35.1 22.2,33.6 v75.67,33.6
EN
  Top 0.152: U4.7 80.6,24.31 80.88,24.59 80.88,26.94 R5.1
  Top 0.305: R5.1 82.59,39.38 84.09,40.88 K4.2
ESP_USB_DM  (via drill 0.25 pad 0.51)
  Top 0.152: U4.25 75.7,20.17 75.54,20.01 72.62,20.01 v72.37,20.27 | J9.A7 76.43,7.95 v76.68,8.2 | J9.B7 75.92,4.77 v76.05,4.65
  Bottom 0.152: v76.05,4.65 76.68,5.28 v76.68,8.2 72.37,12.52 v72.37,20.27
ESP_USB_DP  (via drill 0.25 pad 0.51)
  Top 0.152: U4.26 76.2,20.18 75.65,19.63 v71.86,19.63 | J9.B6 76.43,6.07 v76.2,6.3 75.93,6.57 J9.A6
  Bottom 0.152: v76.2,6.3 76.17,7.95 71.86,12.27 v71.86,19.63
GND  (via drill 0.25 pad 0.51)
  Top 0.203: U2.35 40.91,49.13 v40.62,48.84 | U2.23 48.78,48.55 v49,48.34 | U2.44 37.58,45.55 v37.31,45.29 | U2.47 37.28,44.05 v37.06,44.27 | U2.8 43.91,42.99 v43.79,43.13 | C30.2 v84.69,27.76 | C4.1 v78.08,16.71
  Top 0.406: C5.1 75.48,16.08 v74.91,15.51 | 75.67,16.08 75.73,16.01 v75.73,15.32 75.67,15.32 75.03,14.68
  other vias: 83.54,14.81 82.65,21.66 83.67,21.66 84.69,21.66 85.7,21.66 86.72,21.66 87.73,21.66 81,19.89 81.26,19 83.8,18.24 84.81,18.24 85.95,18.24 82.53,16.71 83.8,16.71 85.07,16.71 86.34,16.71 84.3,17.47 85.45,17.47 88.24,19.89 88.24,20.9 88.24,18.62 88.24,17.6 88.24,16.71 88.88,21.66 90.15,21.66 91.42,21.66 93.32,20.9 89.13,20.9 93.32,16.46 92.18,15.7 92.05,17.09 93.32,17.73 95.35,17.73 90.27,17.09 89.51,17.73 81.51,17.73 49.51,26.62 50.78,26.62 46.71,27.89 52.05,26.62 53.95,26.62 53.06,27.25 55.22,26.62 69.83,23.06 58.02,26.62 68.56,23.06 69.7,25.22 69.45,29.41 77.45,23.06 76.3,24.21 78.59,24.21 78.59,21.92 76.3,21.92 45.7,27 45.7,27.89 67.41,23.06 34.01,26.62 31.73,26.62 28.8,26.11 63.48,22.93 83.67,24.33 84.81,24.33 85.95,24.33 87.61,26.87 87.86,24.33 88.24,25.35 89.51,24.33 81.51,16.08 83.16,16.08 84.43,16.08 85.7,16.08 86.97,16.08 88.37,15.95 90.15,15.82 92.05,23.06 90.78,23.06 89.51,23.06 90.78,24.97 92.05,24.33 89.51,25.35 89.51,27.51 91.42,26.24 92.05,27.51 92.05,26.75 92.05,25.6 90.65,24.08 52.17,27.76 58.02,24.46 70.33,20.27 71.73,21.16 72.49,21.92 68.56,12.52 70.46,21.16 51.03,15.7 77.19,10.62 45.31,16.46 51.28,19.89 48.62,16.71 47.98,14.93 53.44,16.08 44.17,18.36 22.96,25.86 79.99,18.87 8.87,24.08 7.34,31.19 6.96,27.38 41.89,24.71 40.36,22.17 40.36,20.39 59.41,29.41 43.92,21.54 36.93,37.54 39.47,37.67 34.27,42.49 40.87,47.19 40.87,45.29 51.28,47.19 43.41,65.1 32.11,65.23 34.9,59.38 45.19,60.15 48.62,64.84 51.03,58.24 59.79,66.37 59.79,56.72 61.82,53.29 77.57,63.19 76.56,61.42 74.65,60.78 74.65,63.07 76.05,64.34 77.83,64.97 79.1,65.99 80.62,66.24 82.15,65.86 82.53,63.7 81.89,62.18 80.62,61.42 78.46,61.67 77.57,59.77 79.35,58.88 80.88,59.77 83.29,60.15 83.8,61.67 84.43,63.32 83.67,64.97 82.02,64.84 83.16,66.75 81.64,67.77 79.22,67.77 77.06,66.62 75.16,65.35 73.51,64.59 70.97,64.21 68.17,40.08 70.97,40.59 79.61,47.7 78.08,43.13 74.02,28.14 71.22,28.52 83.42,27.89 81.64,14.55 81.76,12.9 74.27,13.92 70.21,18.36 67.16,13.79 83.03,11.12 69.7,11.51 75.41,11.63 77.95,11.63 80.24,11.25 71.6,10.49 67.29,19.38 65.64,14.81 61.44,14.68 63.6,10.24 60.17,11.25 56.36,9.73 61.82,4.01 74.02,1.85 75.92,3 79.22,1.98 80.75,9.09 82.78,3.25 69.45,7.57 70.72,3.5 51.92,41.48 58.9,42.24 52.68,45.92 61.06,46.68 54.97,51 45.82,48.46 45.19,44.14 48.24,41.35 36.3,48.84 34.52,48.84 31.6,53.41 30.84,48.59 30.84,45.67 30.96,41.48 30.2,38.56 34.27,38.56 36.93,41.1 27.03,47.06 27.15,42.24 25,61.04 26.9,56.72 39.35,56.08 47.73,56.46 29.44,20.01 17.63,15.95 12.93,49.22 17.12,56.21 19.03,63.96 18.9,58.11 20.17,48.21 24.61,20.9 37.31,10.24 37.7,17.47 42.52,10.74 42.01,15.44 32.61,11 32.11,7.31 18.26,10.87 29.19,1.34 21.44,2.23 58.4,4.39 62.08,39.95 61.95,41.35 41.89,38.43 48.87,39.95 78.59,23.06 77.45,24.21 76.3,23.06 77.45,21.92 61.32,29.54 61.57,27.89 54.97,19.38 48.24,24.71 41,27.25 38.71,25.48 37.19,25.22 37.57,21.28 33.25,21.79 24.87,29.29 15.34,21.92 14.33,20.39 27.28,17.98 32.49,17.98 36.55,65.86 53.82,66.24 44.68,62.3 52.17,62.18 48.24,59.26 47.85,52.02 68.3,56.34 66.27,57.86 75.67,56.59 78.46,57.73 88.62,51.51 88.62,46.94 79.99,56.46 80.75,53.67 85.19,46.81 83.8,42.75 85.7,38.94 84.94,35.13 86.08,28.65 78.21,40.21 72.75,43.13
  pour Top (isolate 0.254, rank 6): -3.58,70.81 101.7,70.81 101.7,-5 -3.58,-5
  pour Bottom (isolate 0.254, rank 6): -3.58,70.81 101.7,70.81 101.7,-5 -3.58,-5
LORA_RX
  Top 0.305: U1.9 80.96,50.15 R7.1
LORA_TX
  Top 0.305: U1.10 81.02,51.4 R9.1
N$1
  Top 0.406: D4.- 20.42,20.14 19.66,19.38 18.14,19.38 R1.2
N$2
  Top 0.305: R2.1 D1.+
N$3  (via drill 0.25 pad 0.51)
  Top 0.406: v48.24,27.89 48.24,29.22 C14.1
  Top 0.508: U9.2 50.14,24.59
  Top 0.813: 50.14,21.97 L1.1
  Top 1.016: 50.14,24.59 v50.14,24.08 50.14,21.97
  Bottom 0.406: v48.24,27.89 48.24,25.98 v50.14,24.08
N$4
  Top 0.145: ANT2.D 77.4,63.89 arc90 75.48,61.98 U1.15
N$5
  Top 0.305: R4.2 23.09,1.85 22.2,2.74 SW1.CH1A
N$7
  Top 0.305: SW2.COM1 R12.2
N$8
  Top 0.305: U3.3 64.59,24.18 67.41,24.26
  Top 0.813: L2.1 64.53,24.25 67.41,24.26
N$11
  Top 0.813: F2.1 D3.1
N$14
  Top 0.152: U4.28 77.2,19.89 75.8,18.49 74.91,18.49 R13.2
N$15
  Top 0.305: D2.+ R3.1
N$16
  Top 0.305: R10.2 R11.2 U3.5
N$17
  Top 0.203: U4.21 72.5,22.81 R8.1
N$21
  Top 0.203: R17.2 C29.1 86.34,26.36 86.34,26.96 X3.2
N$22
  Top 0.145: C46.2 C35.2 | C36.1 C35.2 | U4.1 80.23,21.31 arc-45 80.63,21.15 C35.2
N$23
  Top 0.145: C49.1 C36.2
N$27
  Top 0.305: U9.6 49.19,29.41 C14.2
N$28
  Top 0.145: C46.1 C48.2 | C49.2 C48.2 | C48.2 ANT.D
N$29
  Top 0.305: U9.4 R22.1 | R23.2 C24.1 R22.1
  Top 0.508: R22.1
N$34
  Top 0.254: U4.2 80.51,21.81 80.75,22.05 80.48,22.31 U4.3
  Top 0.508: L3.2 C50.2 82.02,22.05 80.75,22.05
NC
  Top 0.406: J1.12 J1.11 J1.10
OSC_IN
  Top 0.305: C1.2 38.84,39.32 X4.1 39.98,39.45 40.87,40.33 42.01,40.33 42.41,40.73 U2.5
OSC_OUT
  Top 0.305: U2.6 42.91,39.57 C2.2 42.01,36.91 X4.3
PA15/SDA
  Top 0.254: U2.43 36.17,46.05 R16.2
PB15/SCL
  Top 0.254: U2.42 36.17,46.55 R19.2
RST
  Top 0.305: U1.17 72.98,62.16 R6.2
RX_D7  (via drill 0.25 pad 0.51)
  Top 0.152: U4.27 76.7,20.15 v75.54,19
  Top 0.305: R9.2 83.67,50.49 83.67,48.97 81.26,46.56 v81.26,36.78 | J12.1 54.13,55.4 64.11,45.41 v64.11,36.78
  Bottom 0.305: J1.9 19.66,45.03 27.92,36.78 v64.11,36.78 v81.26,36.78 81.89,36.14 81.89,23.19 77.7,19 v75.54,19
SCL  (via drill 0.25 pad 0.51)
  Top 0.152: U4.13 v77.2,34.87 v77.19,34.87
  Top 0.305: J10.1 36.98,63.62 37.7,64.34 37.7,67 36.81,67.89 31.09,67.89 29.82,66.62 29.82,40.31 28.2,38.68 20.68,38.68 19.66,37.67 J1.6
  Bottom 0.305: J1.6 20.7,37.64 23.47,34.87 v77.19,34.87
SDA  (via drill 0.25 pad 0.51)
  Top 0.152: U4.12 v77.7,35.5 v77.7,35.51
  Top 0.305: J10.2 38.98,63.69 38.33,64.34 38.33,67.26 37.06,68.53 30.79,68.53 29.19,66.92 29.19,40.59 27.92,39.32 20.55,39.32 19.69,40.18 J1.7
  Bottom 0.305: J1.7 19.66,39.95 24.11,35.51 v77.7,35.51
SWC_GD  (via drill 0.25 pad 0.51)
  Top 0.305: U2.37 38.76,51.34 v38.71,51.38
  Bottom 0.305: v38.71,51.38 23.3,51.38 20.93,53.76 20.93,65.35 J4.1
SWD_GD  (via drill 0.25 pad 0.51)
  Top 0.305: U2.34 41.41,51.86 v41.25,52.02
  Bottom 0.305: v41.25,52.02 23.55,52.02 21.57,54 J4.2
TX_D6  (via drill 0.25 pad 0.51)
  Top 0.305: R7.2 82.65,48.84 80.62,46.81 v80.62,36.14 | J12.2 56.13,54.41 64.75,45.8 v64.75,36.14 | R13.1 73.13,16.97 73.13,18.36 73.76,19 v74.59,19
  Bottom 0.305: J1.8 19.66,42.49 26.01,36.14 v64.75,36.14 v80.62,36.14 81.26,35.51 81.26,23.44 77.45,19.63 75.23,19.63 74.78,19.18 v74.59,19
USB_5V
  Top 0.305: J9.B4 J9.A9 77.43,8.48 77.06,8.84 75.03,8.84 | J9.B9 J9.A4 74.93,8.18 75.03,8.2
  Top 0.813: 75.03,8.2 75.03,8.84 75.03,9.09 68.97,15.16 F2.2
VDD_SPI
  Top 0.203: U4.18 73.87,24.31 73.38,23.82 71.73,23.82 R8.2
VIN
  Top 1.016: D6.1 J2.1 57.13,16.04 J7.3
VIN_12V
  Top 0.508: U9.3 52.3,25.48 C3.2
  Top 0.813: D6.2 53.06,21.55 C3.2 53.44,24.33 C6.2
XTAL_N
  Top 0.152: X2.3 76.3,14.11 76.3,16.84 C5.2 77.7,19.76 U4.29
XTAL_P
  Top 0.152: U4.30 78.2,18.35 C4.2 76.68,16.84 76.68,15.44 77.32,14.81 X2.1

### Text on the board
tPlace: ANT | RX | TX | SCL | SDA | 3V3 | GND | 3V3 | GND | RX | TX | BOOT | NC | RX | NC | TX | RST | NC | SDA | A3 | SCL | A2 | D10 | A1 | D9 | A0 | D8 | 5V | GND | 3V | GND | PWR | WIFI | CAN1L | CAN1H | VIN | GND | CAN0L | CAN0H | CAN1 | 120Ω | CAN0
bPlace: Wio Dual CAN FD Kit | by Seeed Studio